# EAGLE design Noninvasive Nexmeter (EAGLE 9.5.0)
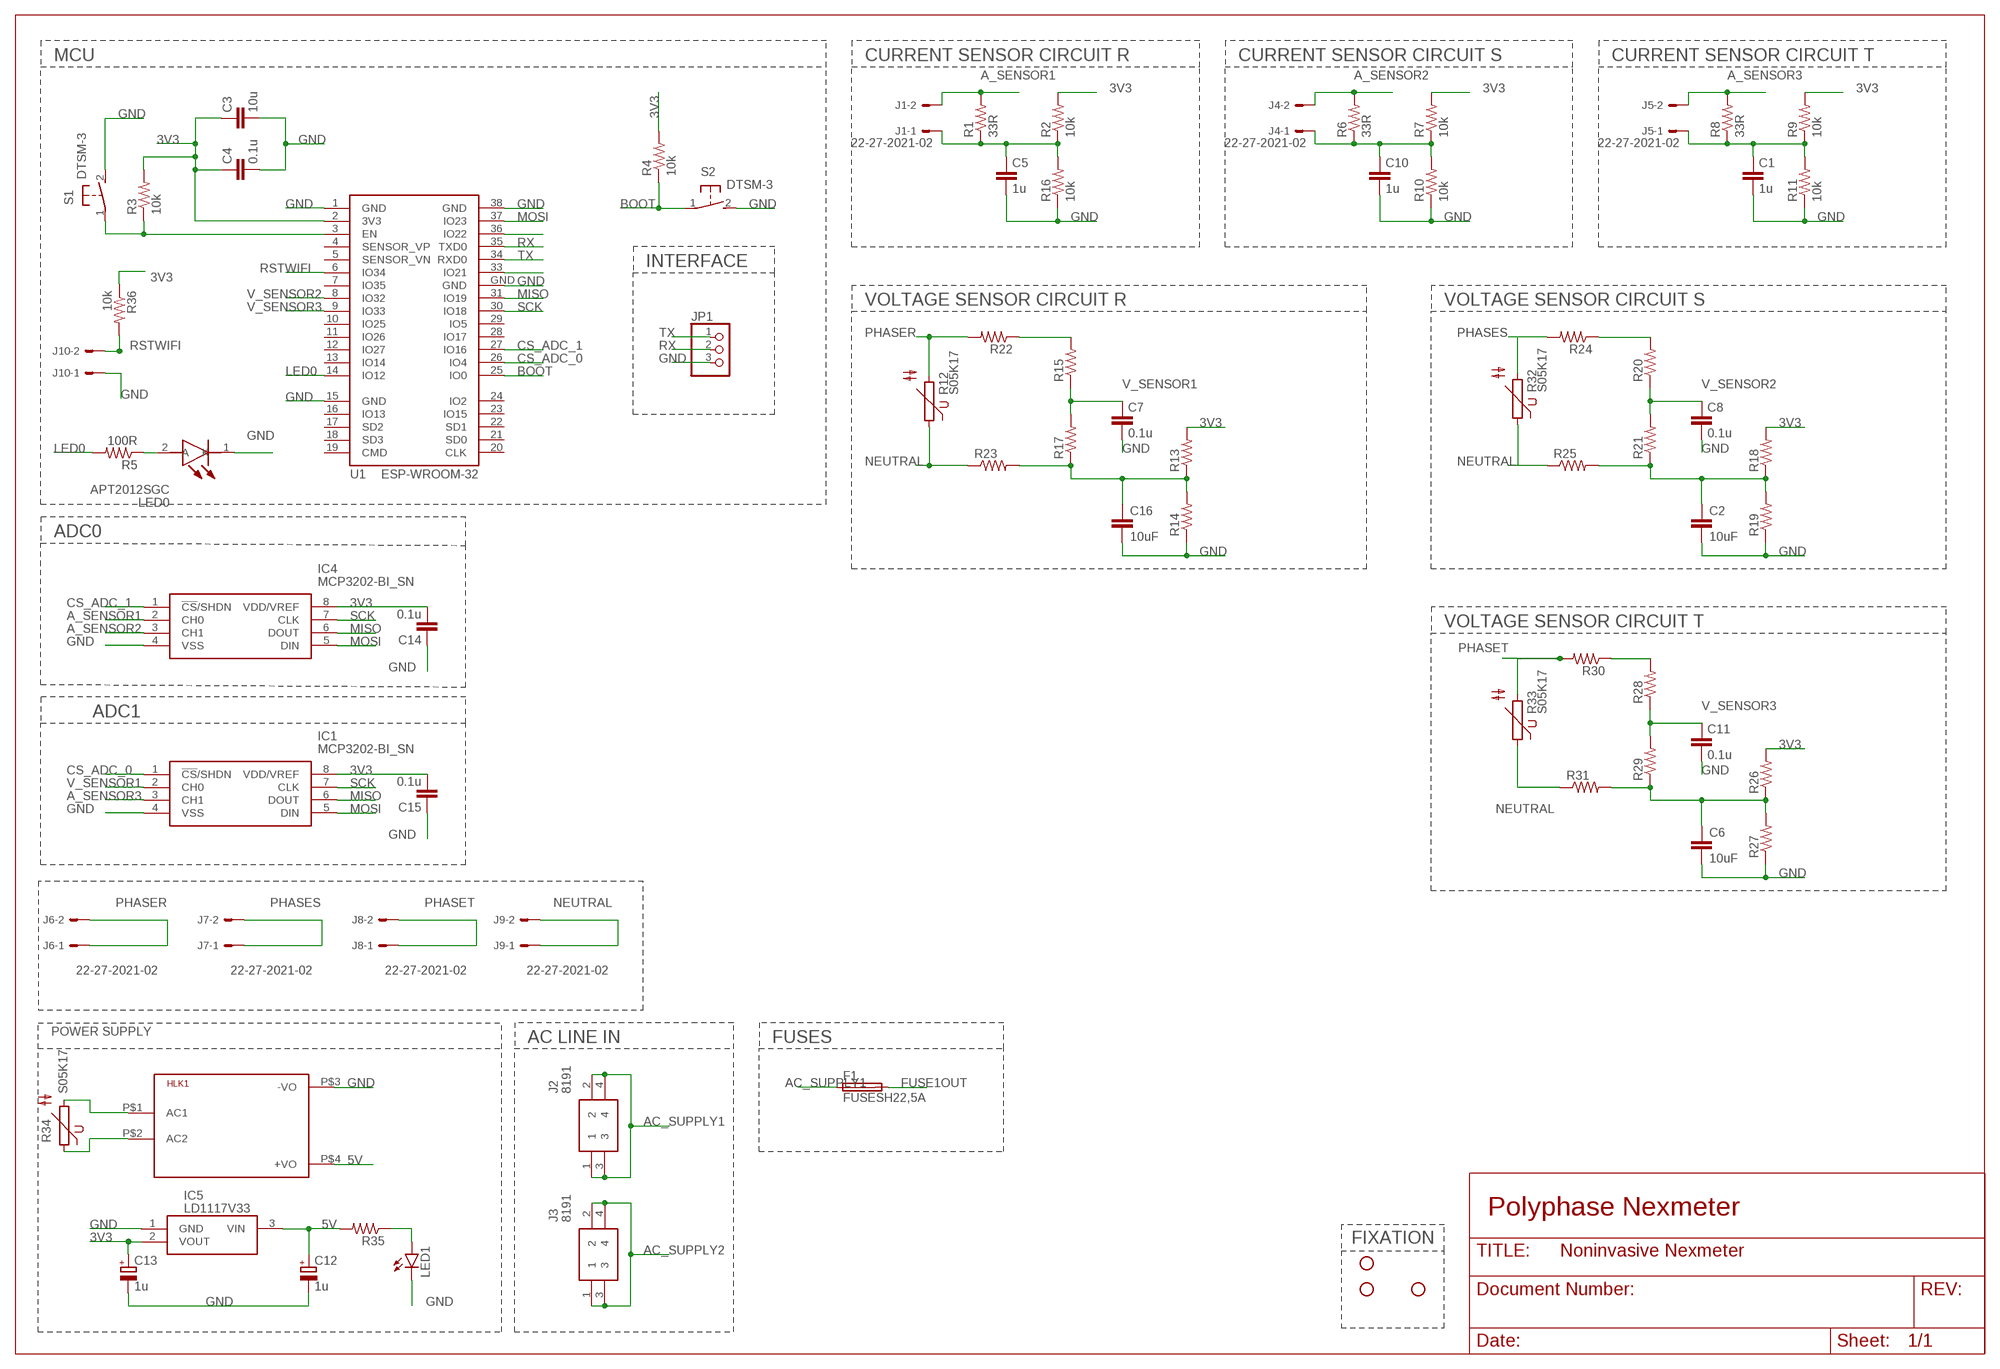
[diagram p0: schematic, sheet 1]

## Parts
C1  1u  C-EUC0805  [C0805]
C2  10uF  RCL_C-EUC0805  [RCL_C0805]
C3  10u  C-EUC0805  [C0805]
C4  0.1u  C-EUC0805  [C0805]
C5  1u  C-EUC0805  [C0805]
C6  10uF  RCL_C-EUC0805  [RCL_C0805]
C7  0.1u  C-EUC0805  [C0805]
C8  0.1u  C-EUC0805  [C0805]
C10  1u  C-EUC0805  [C0805]
C11  0.1u  C-EUC0805  [C0805]
C12  1u  CPOL-EUE1.8-4  [E1,8-4]
C13  1u  CPOL-EUE1.8-4  [E1,8-4]
C14  0.1u  C-EUC0805  [C0805]
C15  0.1u  C-EUC0805  [C0805]
C16  10uF  RCL_C-EUC0805  [RCL_C0805]
F1  FUSESH22,5A  [SH22,5A]
HLK1  HLK-PM013W  [HLK-PM01]
IC1  MCP3202-BI_SN  [SOIC127P600X175-8N]
IC4  MCP3202-BI_SN  [SOIC127P600X175-8N]
IC5  LD1117V33  [TO270P460X1020X2008-3P]
J1  22-27-2021-02  [6410-02]
J2  8191  [8191]
J3  8191  [8191]
J4  22-27-2021-02  [6410-02]
J5  22-27-2021-02  [6410-02]
J6  22-27-2021-02  [6410-02]
J7  22-27-2021-02  [6410-02]
J8  22-27-2021-02  [6410-02]
J9  22-27-2021-02  [6410-02]
J10  22-27-2021-02  [6410-02]
JP1  PINHD-1X3  [1X03]
LED0  APT2012SGC  [LEDC2012X85N]
LED1  LED5MM  [LED5MM]
R1  33R  R-US_R0805  [R0805]
R2  10k  R-US_R0805  [R0805]
R3  10k  R-US_R0805  [R0805]
R4  10k  R-US_R0805  [R0805]
R5  100R  R-US_R0805  [R0805]
R6  33R  R-US_R0805  [R0805]
R7  10k  R-US_R0805  [R0805]
R8  33R  R-US_R0805  [R0805]
R9  10k  R-US_R0805  [R0805]
R10  10k  R-US_R0805  [R0805]
R11  10k  R-US_R0805  [R0805]
R12  S05K17  [S05K17]
R13  RESISTOR0805  [0805]
R14  RESISTOR0805  [0805]
R15  RESISTOR0805  [0805]
R16  10k  R-US_R0805  [R0805]
R17  RESISTOR0805  [0805]
R18  RESISTOR0805  [0805]
R19  RESISTOR0805  [0805]
R20  RESISTOR0805  [0805]
R21  RESISTOR0805  [0805]
R22  RESISTOR0805  [0805]
R23  RESISTOR0805  [0805]
R24  RESISTOR0805  [0805]
R25  RESISTOR0805  [0805]
R26  RESISTOR0805  [0805]
R27  RESISTOR0805  [0805]
R28  RESISTOR0805  [0805]
R29  RESISTOR0805  [0805]
R30  RESISTOR0805  [0805]
R31  RESISTOR0805  [0805]
R32  S05K17  [S05K17]
R33  S05K17  [S05K17]
R34  S05K17  [S05K17]
R35  RESISTORAXIAL-0.3  [AXIAL-0.3]
R36  10k  R-US_R0805  [R0805]
S1  DTSM-3  [DTSM-3]
S2  DTSM-3  [DTSM-3]
STANDOFF1  STAND-OFF  [STAND-OFF]
STANDOFF2  STAND-OFF  [STAND-OFF]
STANDOFF4  STAND-OFF  [STAND-OFF]
U1  ESP-WROOM-32  [ESP-WROOM-32]

## Nets
3V3: C3.1 C4.1 C13.+ C14.2 C15.2 IC1.8(VDD/VREF) IC4.8(VDD/VREF) IC5.2(VOUT) R2.2 R3.2 R4.2 R7.2 R9.2 R13.2 R18.2 R26.2 R36.1 U1.2(3V3)
5V: C12.+ HLK1.P$4(+VO) IC5.3(VIN) R35.P$2
A_SENSOR1: IC4.2(CH0) J1.2 R1.2
A_SENSOR2: IC4.3(CH1) J4.2 R6.2
A_SENSOR3: IC1.3(CH1) J5.2 R8.2
AC_SUPPLY1: F1.1 J2.1 J2.2 J2.3 J2.4
AC_SUPPLY2: HLK1.P$2(AC2) J3.1 J3.2 J3.3 J3.4 R34.1
BOOT: R4.1 S2.1 U1.25(IO0)
CS_ADC_0: IC1.1(!CS!/SHDN) U1.26(IO4)
CS_ADC_1: IC4.1(!CS!/SHDN) U1.27(IO16)
FUSE1OUT: F1.2 HLK1.P$1(AC1) R34.2
GND: C1.2 C2.2 C3.2 C4.2 C5.2 C6.2 C7.2 C8.2 C10.2 C11.2 C12.- C13.- C14.1 C15.1 C16.2 HLK1.P$3(-VO) IC1.4(VSS) IC4.4(VSS) IC5.1(GND) J10.1 JP1.3 LED0.1(K) LED1.K(C) R10.1 R11.1 R14.1 R16.1 R19.1 R27.1 S1.2 S2.2 U1.1(GND) U1.15(GND) U1.38(GND) U1.GND
LED0: R5.2 U1.14(IO12)
MISO: IC1.6(DOUT) IC4.6(DOUT) U1.31(IO19)
MOSI: IC1.5(DIN) IC4.5(DIN) U1.37(IO23)
N$1: R20.2 R24.1
N$2: C1.1 J5.1 R8.1 R9.1 R11.2
N$3: C2.1 R18.1 R19.2 R21.1 R25.2
N$4: LED0.2(A) R5.1
N$5: R3.1 S1.1 U1.3(EN)
N$6: R28.2 R30.1
N$7: R15.2 R22.1
N$8: U1.33(IO21)
N$9: C10.1 J4.1 R6.1 R7.1 R10.2
N$10: C16.1 R13.1 R14.2 R17.1 R23.2
N$11: U1.36(IO22)
N$12: C6.1 R26.1 R27.2 R29.1 R31.2
N$13: LED1.A R35.P$1
N$16: C5.1 J1.1 R1.1 R2.1 R16.2
NEUTRAL: J9.1 J9.2 R12.1 R23.1 R25.1 R31.1 R32.1 R33.1
PHASER: J6.1 J6.2 R12.2 R22.2
PHASES: J7.1 J7.2 R24.2 R32.2
PHASET: J8.1 J8.2 R30.2 R33.2
RSTWIFI: J10.2 R36.2 U1.6(IO34)
RX: JP1.2 U1.35(TXD0)
SCK: IC1.7(CLK) IC4.7(CLK) U1.30(IO18)
TX: JP1.1 U1.34(RXD0)
V_SENSOR1: C7.1 IC1.2(CH0) R15.1 R17.2
V_SENSOR2: C8.1 R20.1 R21.2 U1.8(IO32)
V_SENSOR3: C11.1 R28.1 R29.2 U1.9(IO33)
Unconnected: U1.4(SENSOR_VP) U1.5(SENSOR_VN) U1.7(IO35) U1.10(IO25) U1.11(IO26) U1.12(IO27) U1.13(IO14) U1.16(IO13) U1.17(SD2) U1.18(SD3) U1.19(CMD) U1.20(CLK) U1.21(SD0) U1.22(SD1) U1.23(IO15) U1.24(IO2) U1.28(IO17) U1.29(IO5)

## Notes on the sheet
- MCU | CURRENT SENSOR CIRCUIT R | CURRENT SENSOR CIRCUIT S | CURRENT SENSOR CIRCUIT T
- INTERFACE
- VOLTAGE SENSOR CIRCUIT R | VOLTAGE SENSOR CIRCUIT S
- ADC0
- VOLTAGE SENSOR CIRCUIT T
- ADC1
- POWER SUPPLY
- AC LINE IN | FUSES
- Polyphase Nexmeter
- FIXATION

## Library data of the parts
C1 C3-C5 C7 C8 C10 C11 C14 C15 = rcl:C-EU: CAPACITOR, European symbol; SPICEPREFIX: C
C2 C6 C16 = ac_monitor:RCL_C-EU: CAPACITOR, European symbol; SPICEPREFIX: C
C12 C13 = rcl:CPOL-EU: POLARIZED CAPACITOR, European symbol; SPICEPREFIX: C
F1 = fuse:FUSE: Fuse; OC_FARNELL: unknown; OC_NEWARK: unknown
HLK1 = HLK-PM01:HLK-PM01: Hi-Link Power Supply HLK-PM01 3W Author: Ahmed Said <https://github.com/AhmedSaid/EAGLELibraries>
IC1 IC4 = SamacSys_Parts:MCP3202-BI_SN: IC, A-D, Converter, 12 bit, SMT, MCP3202BISN Source: Datasheet <https://componentsearchengine.com/Datasheets/1/MCP3202-BI_SN.pdf>; DESCRIPTION: IC, A-D, Converter, 12 bit, SMT, MCP3202BISN; HEIGHT: 1.75mm; MANUFACTURER_NAME: Microchip; MANUFACTURER_PART_NUMBER: MCP3202-BI/SN; MOUSER_PART_NUMBER: 579-MCP3202BISN; MOUSER_PRICE-STOCK: https://www.mouser.com/Search/Refine.aspx?Keyword=579-MCP3202BISN
IC5 = SamacSys_Parts:LD1117V33: 800mA,3.3V,LDO Voltage Reg.,LD1117V33 STMicroelectronics LD1117V33, LDO Voltage Regulator, 1.3A, 3.3 V +/-1%, 3-Pin TO-220 Source: Datasheet <https://componentsearchengine.com/Datasheets/1/LD1117V33.pdf>; DESCRIPTION: 800mA,3.3V,LDO Voltage Reg.,LD1117V33 STMicroelectronics LD1117V33, LDO Voltage Regulator, 1.3A, 3.3 V +/-1%, 3-Pin TO-220; HEIGHT: 4.6mm; MANUFACTURER_NAME: STMicroelectronics; MANUFACTURER_PART_NUMBER: LD1117V33; MOUSER_PART_NUMBER: 511-LD1117V33; MOUSER_PRICE-STOCK: https://www.mouser.com/Search/Refine.aspx?Keyword=511-LD1117V33
J1 J4-J10 = con-molex:22-?-02: CONNECTOR wire to board 2.54 mm (.1 inch) pitch header; MF: MOLEX; OC_FARNELL: unknown; OC_NEWARK: unknown
J2 J3 = SamacSys_Parts:8191: Screw terminal, PC mount, vertical, with screw, metal, 15 Amps Source: Datasheet <https://componentsearchengine.com/Datasheets/1/8191.pdf>; DESCRIPTION: Screw terminal, PC mount, vertical, with screw, metal, 15 Amps; HEIGHT: 6.56mm; MANUFACTURER_NAME: Keystone Electronics; MANUFACTURER_PART_NUMBER: 8191; MOUSER_PART_NUMBER: 534-8191; MOUSER_PRICE-STOCK: https://www.mouser.com/Search/Refine.aspx?Keyword=534-8191
JP1 = pinhead:PINHD-1X3: PIN HEADER
LED0 = SamacSys_Parts:APT2012SGC: 2.5 V Green LED 2012 (0805) SMD, Kingbright APT2012SGC Source: Datasheet <https://componentsearchengine.com/Datasheets/1/APT2012SGC.pdf>; DESCRIPTION: 2.5 V Green LED 2012 (0805) SMD, Kingbright APT2012SGC; HEIGHT: 0.85mm; MANUFACTURER_NAME: Kingbright; MANUFACTURER_PART_NUMBER: APT2012SGC; MOUSER_PART_NUMBER: 604-APT2012SGC; MOUSER_PRICE-STOCK: https://www.mouser.com/Search/Refine.aspx?Keyword=604-APT2012SGC
LED1 = led:LED: LED OSRAM: - CHIPLED LG R971, LG N971, LY N971, LG Q971, LY Q971, LO R971, LY R971 LH N974, LH R974 LS Q976, LO Q976, LY Q976 LO Q996 - Hyper CHIPLED LW Q18S LB Q993, LB Q99A, LB R99A - SideLED LS A670, LO A670, LY A670, LG A670, LP A670 LB A673, LV A673, LT A673, LW A673 LH A674 LY A675 LS A676, LA A676, LO A676, LY A676, LW A676 LS A679, LY A679, LG A679 - Hyper Micro SIDELED® LS Y876, LA Y876, LO Y876, LY Y876 LT Y87S - SmartLED LW L88C, LW L88S LB L89C, LB L89S, LG L890 LS L89K, LO L89K, LY L89K LS L896, LA L896, LO L896, LY L896 - TOPLED LS T670, LO T670, LY T670, LG T670, LP T670 LSG T670, LSP T670, LSY T670, LOP T670, LYG T670 LG T671, LOG T671, LSG T671 LB T673, LV T673, LT T673, LW T673 LH T674 LS T676, LA T676, LO T676, LY T676, LB T676, LH T676, LSB T676, LW T676 LB T67C, LV T67C, LT T67C, LS T67K, LO T67K, LY T67K, LW E67C LS E67B, LA E67B, LO E67B, LY E67B, LB E67C, LV E67C, LT E67C LW T67C LS T679, LY T679, LG T679 LS T770, LO T770, LY T770, LG T770, LP T770 LB T773, LV T773, LT T773, LW T773 LH T774 LS E675, LA E675, LY E675, LS T675 LS T776, LA T776, LO T776, LY T776, LB T776 LHGB T686 LT T68C, LB T68C - Hyper Mini TOPLED® LB M676 - Mini TOPLED Santana® LG M470 LS M47K, LO M47K, LY M47K Source: http://www.osram.convergy.de LUXEON: - LUMILED® LXK2-PW12-R00, LXK2-PW12-S00, LXK2-PW14-U00, LXK2-PW14-V00 LXK2-PM12-R00, LXK2-PM12-S00, LXK2-PM14-U00 LXK2-PE12-Q00, LXK2-PE12-R00, LXK2-PE12-S00, LXK2-PE14-T00, LXK2-PE14-U00 LXK2-PB12-K00, LXK2-PB12-L00, LXK2-PB12-M00, LXK2-PB14-N00, LXK2-PB14-P00, LXK2-PB14-Q00 LXK2-PR12-L00, LXK2-PR12-M00, LXK2-PR14-Q00, LXK2-PR14-R00 LXK2-PD12-Q00, LXK2-PD12-R00, LXK2-PD12-S00 LXK2-PH12-R00, LXK2-PH12-S00 LXK2-PL12-P00, LXK2-PL12-Q00, LXK2-PL12-R00 Source: www.luxeon.com KINGBRIGHT: KA-3528ASYC Source: www.kingbright.com
R1-R11 R16 R36 = rcl:R-US_: RESISTOR, American symbol; SPICEPREFIX: R
R12 R32-R34 = varistor:S05K17: VARISTOR
R13-R15 R17-R31 R35 = SparkFun-Resistors:RESISTOR: Generic Resistor Package
S1 S2 = switch-tact:DTSM-3
STANDOFF1 STANDOFF2 STANDOFF4 = SparkFun-Hardware:STAND-OFF: Stand Off Drill holes for mechanically mounting via screws, standoffs, etc. Note: Use the keepout ring to avoid running the screw head into surrounding components. Variant Overviews STAND-OFF - Mechanical footprint for a #4 phillips button head screw. STAND-OFF-TIGHT - Mechanical footprint for a #4 phillips button head screw, Example SparkFun Products Screw - Phillips Head (1/4", 4-40, 10 pack) <https://www.sparkfun.com/products/10453> (PRT-10453) Screw - Phillips Head (1/2", 4-40, 10 pack) <https://www.sparkfun.com/products/10452> (PRT-10452) Screw - Phillips Head (3/4", 4-40, 10 pack) <https://www.sparkfun.com/products/10451> (PRT-10451) Screw - Phillips Head (1", 4-40, 10 pack) <https://www.sparkfun.com/products/10450> (PRT-10450)
U1 = esp32:ESP-WROOM-32: Espressif Systems ESP-WROOM-32

## Board
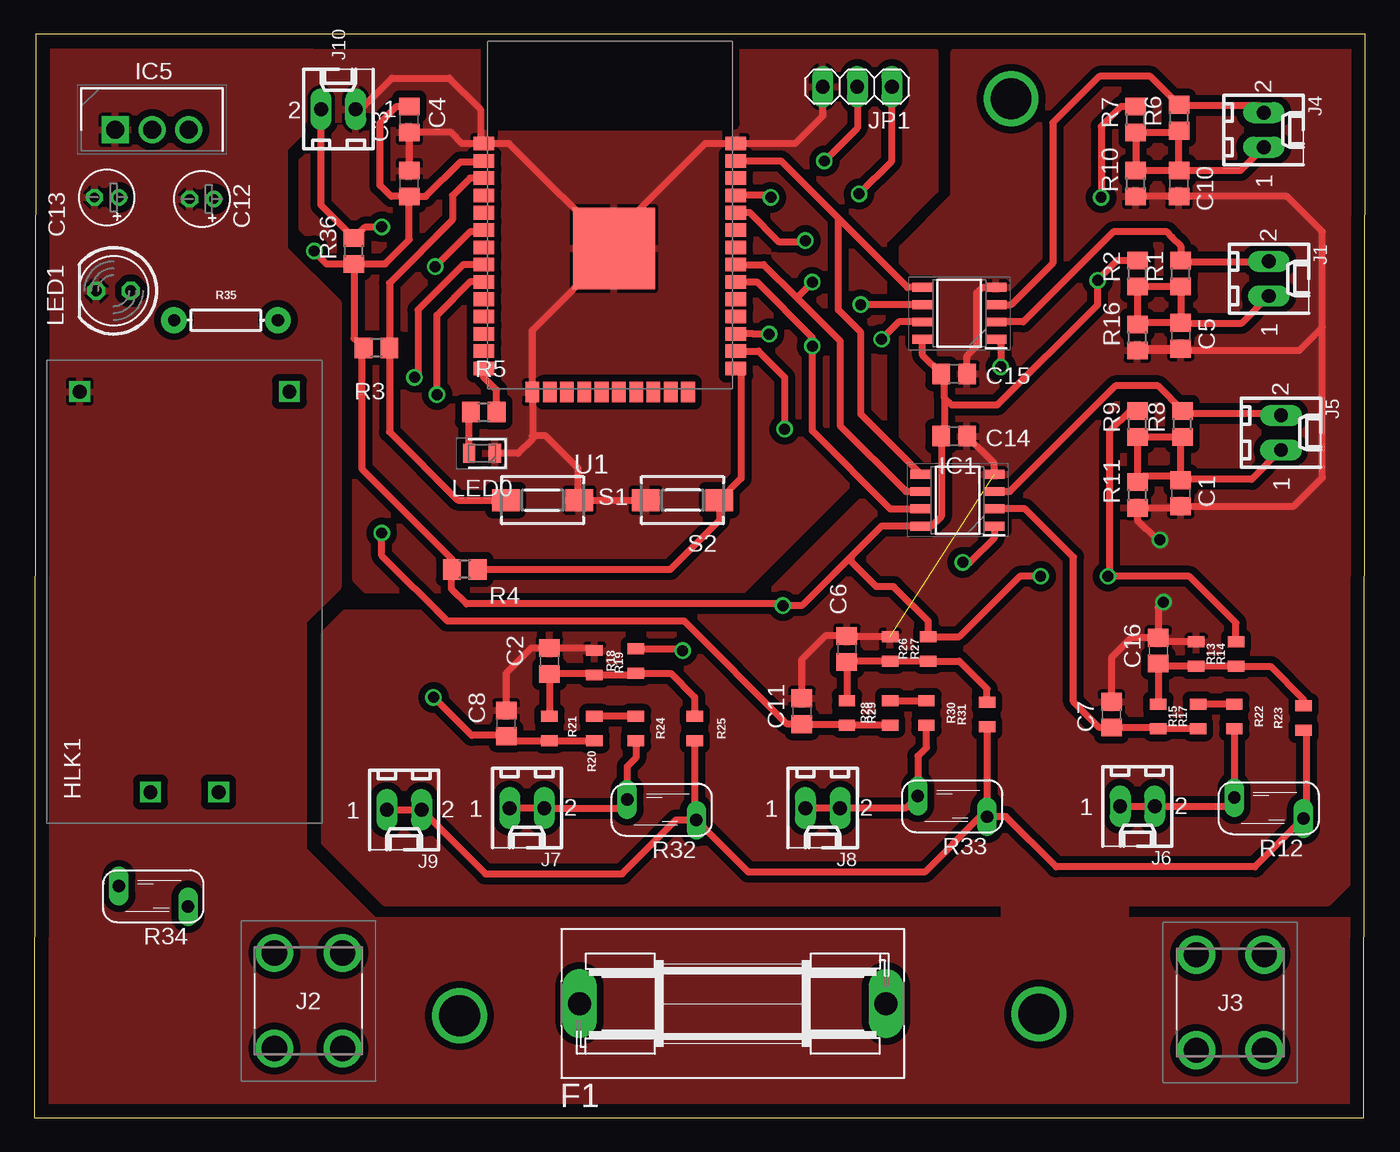
[diagram p1: board, top side]
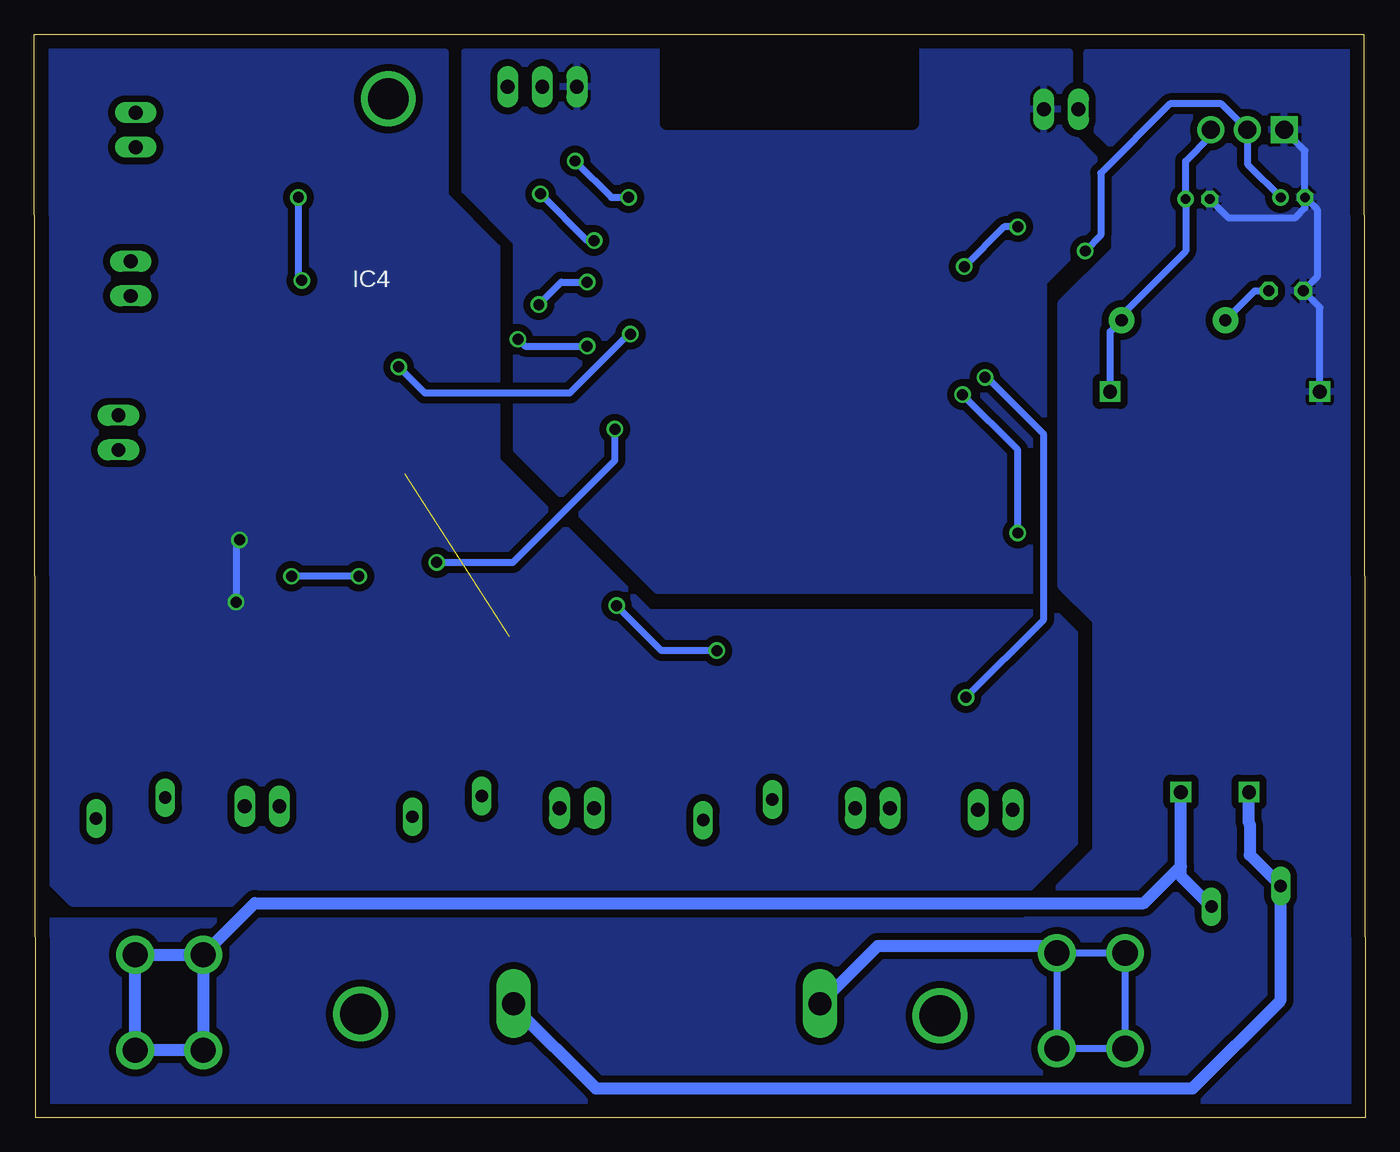
[diagram p2: board, bottom side, seen from below]

Size 97.77 x 79.55 mm. Coordinates in mm from the lower left corner, seen from the top.
Outline: 0,0 97.64,0 97.77,79.55 0.13,79.55 0,0
Copper layers (1*16): Top 0.035mm / dielectric 1.5mm / Bottom 0.035mm
Design rules "default *": minimum track width 10mil, minimum drill 0.35mm, track to track 10mil, track to pad 10mil, pad to pad 10mil, via to via 10mil, smd to smd 10mil, copper to edge 40mil, drill to drill 6mil, minimum pad ring 10mil, minimum via ring 8mil, stop-mask expansion 4mil, vias tented up to drill 0mil, thermal gap 10mil

### Footprints (pad centres in the part's own frame; a part is rotated, then mirrored left to right if it is on the bottom)
C0805 = smd 1.3 x 1.5: 1 -0.95,0; 2 0.95,0
RCL_C0805 = smd 1.3 x 1.5: 1 -0.95,0; 2 0.95,0
E1,8-4 = drill 0.711 pad 1.168: + -0.889,0 | drill 0.711 pad 1.168 octagon: - 0.889,0
SH22,5A = drill 1.7 pad 2.54 long: 1 -11.252,0; 2 11.252,0
HLK-PM01 = drill 1.016 square: P$1 -14.7,2.5; P$2 -14.7,-2.5; P$3 14.7,7.7; P$4 14.7,-7.7
SOIC127P600X175-8N = smd 1.5 x 0.65: 1 -2.7,1.905; 2 -2.7,0.635; 3 -2.7,-0.635; 4 -2.7,-1.905; 5 2.7,-1.905; 6 2.7,-0.635; 7 2.7,0.635; 8 2.7,1.905
TO270P460X1020X2008-3P = drill 1.32 pad 1.98 square: 1 0,0 | drill 1.32 pad 1.98: 2 2.7,0; 3 5.4,0
6410-02 = drill 1.016 long: 1 1.27,0; 2 -1.27,0
8191 = drill 1.85 pad 2.775: 1 0,0; 2 5,0; 3 5,7.01; 4 0,7.01
1X03 = drill 1.016 long: 1 -2.54,0; 2 0,0; 3 2.54,0
LEDC2012X85N = smd 0.9 x 1.4: 1 -0.95,0; 2 0.95,0
LED5MM = drill 0.813 octagon: A -1.27,0; K 1.27,0
R0805 = smd 1.3 x 1.5: 1 -0.95,0; 2 0.95,0
S05K17 = drill 0.914 long: 1 -0.762,-2.54; 2 0.762,2.54
0805 = smd 0.8 x 1.2: 1 -0.9,0; 2 0.9,0
AXIAL-0.3 = drill 0.9 pad 1.88: P$1 -3.81,0; P$2 3.81,0
DTSM-3 = smd 2 x 1.6: 1 -2.7,0; 2 2.7,0
STAND-OFF = hole 3.2: 0,0
ESP-WROOM-32 = smd 1.5 x 1: 1 -9.25,7; 2 -9.25,5.73; 3 -9.25,4.46; 4 -9.25,3.19; 5 -9.25,1.92; 6 -9.25,0.65; 7 -9.25,-0.62; 8 -9.25,-1.89; 9 -9.25,-3.16; 10 -9.25,-4.43; 11 -9.25,-5.7; 12 -9.25,-6.97; 13 -9.25,-8.24; 14 -9.25,-9.51; 25 9.25,-9.51; 26 9.25,-8.24; 27 9.25,-6.97; 28 9.25,-5.7; 29 9.25,-4.43; 30 9.25,-3.16; 31 9.25,-1.89; 32 9.25,-0.62; 33 9.25,0.65; 34 9.25,1.92; 35 9.25,3.19; 36 9.25,4.46; 37 9.25,5.73; 38 9.25,7 | smd 1 x 1.5: 15 -5.7,-11.25; 16 -4.43,-11.25; 17 -3.16,-11.25; 18 -1.89,-11.25; 19 -0.62,-11.25; 20 0.65,-11.25; 21 1.92,-11.25; 22 3.19,-11.25; 23 4.46,-11.25; 24 5.73,-11.25 | smd 6 x 6: GND 0.3,-0.7

### Placement (x,y rotation side)
C1  84.2,45.85 270 top
C2  37.85,33.53 90 top
C3  27.56,73.28 270 top
C4  27.56,68.58 90 top
C5  84.2,57.4 270 top
C6  59.69,34.42 90 top
C7  79.12,29.59 90 top
C8  34.67,28.96 90 top
C10  84.07,68.58 270 top
C11  56.39,29.85 90 top
C12  12.32,67.44 180 top
C13  5.33,67.56 180 top
C14  67.56,50.04 180 top
C15  67.56,54.61 180 top
C16  82.55,34.29 90 top
F1  51.31,8.38 0 top
HLK1  11.05,38.61 90 top
IC1  67.82,45.34 180 top
IC4  67.95,59.06 180 top
IC5  5.97,72.52 0 top
J1  90.68,61.59 270 top
J2  17.65,5.08 0 top
J3  85.34,4.95 0 top
J4  90.3,72.52 270 top
J5  91.57,50.29 270 top
J6  81.03,22.86 180 top
J7  36.2,22.73 180 top
J8  57.91,22.73 180 top
J9  27.18,22.61 180 top
J10  22.35,74.04 0 top
JP1  60.45,75.69 180 top
LED0  32.89,48.77 180 top
LED1  5.84,60.71 180 top
R1  84.2,61.98 90 top
R2  81.03,61.98 90 top
R3  25.15,56.52 180 top
R4  31.62,40.26 180 top
R5  33.02,51.82 0 top
R6  84.07,73.41 90 top
R7  80.9,73.28 90 top
R8  84.33,50.93 90 top
R9  81.03,50.93 90 top
R10  80.9,68.58 90 top
R11  81.03,45.72 90 top
R12  90.68,22.73 90 top
R13  88.27,34.04 90 top
R14  85.34,34.04 270 top
R15  85.47,29.46 90 top
R16  81.03,57.28 90 top
R17  82.55,29.46 270 top
R18  44.2,33.53 90 top
R19  41.15,33.4 270 top
R20  41.15,28.57 90 top
R21  37.85,28.57 270 top
R22  88.14,29.46 270 top
R23  93.22,29.34 90 top
R24  44.2,28.57 270 top
R25  48.51,28.57 90 top
R26  65.66,34.42 90 top
R27  62.87,34.42 270 top
R28  62.87,29.72 90 top
R29  59.69,29.72 270 top
R30  65.53,29.72 270 top
R31  69.98,29.59 90 top
R32  46.1,22.61 90 top
R33  67.44,22.86 90 top
R34  8.76,16.26 90 top
R35  14.1,58.55 0 top
R36  23.5,63.63 90 top
S1  37.34,45.34 0 top
S2  47.62,45.34 180 top
STANDOFF1  -227.2,130.3 0 top  (outside the outline)
STANDOFF2  -239.9,130.3 0 top  (outside the outline)
STANDOFF4  -233.55,130.3 0 top  (outside the outline)
U1  42.29,64.52 0 top

### Tracks (layer width: path | path; a pad name or v marks a point on that pad's centre or on a via)
3V3  (via drill 0.8)
  Top 0.508: C3.1 26.6,74.23 25.4,73.03 25.4,68.45 26.22,67.63 C4.1 | IC4.8 65.25,55.98 C15.2 66.81,54.42 66.81,54.16 66.87,54.1 66.87,52.83 | R36.1 25.78,62.68 27.56,64.45 C4.1 | 66.87,52.83 66.87,50.29 C14.2 66.61,44.14 65.91,43.43 IC1.8 62.23,43.43 60.01,41.21 | R36.1 23.5,57.22 R3.2 24.1,56.42 24.1,47.59 30.67,41.02 R4.2 30.67,38.8 31.75,37.72 54.86,37.72 v54.99,37.59 56.39,37.59 60.01,41.21 | v20.57,63.63 20.57,63.57 21.46,62.68 R36.1 | 66.87,52.83 67.38,52.32 70.74,52.32 78.11,59.69 v78.11,61.47 78.11,61.53 79.5,62.93 R2.2 | R13.2 88.27,36.33 84.85,39.75 v78.87,39.75 78.99,39.62 78.99,50.42 80.45,51.88 R9.2 | R7.2 79.81,74.23 78.36,72.78 v78.36,67.56 | v73.91,39.75 72.38,39.75 67.95,35.32 R26.2 65.66,36.45 63.12,38.99 61.85,38.99 60.01,40.83 60.01,41.21 | R18.2 47.49,34.43 v47.62,34.29 | U1.2 33.12,70.17 31.31,70.17 28.77,67.63 C4.1
  Bottom 0.508: C13.+ 8.67,70.01 IC5.2 10.57,74.42 14.35,74.42 19.43,69.34 19.43,64.77 v20.57,63.63 | v78.36,67.56 78.36,61.72 v78.11,61.47 | v73.91,39.75 v78.87,39.75 | v54.99,37.59 51.69,34.29 v47.62,34.29
5V
  Bottom 0.508: IC5.3 11.37,72.07 13.21,70.23 C12.+ 13.21,63.63 17.91,58.93 R35.P$2 18.75,57.7 HLK1.P$4
A_SENSOR1
  Top 0.508: J1.2 90.61,62.8 84.33,62.8 R1.2 84.2,64.01 83.57,64.64 | 83.57,64.64 83.19,65.02 79.25,65.02 72.64,58.42 IC4.2 | 83.57,64.64
A_SENSOR2
  Top 0.508: J4.2 90.04,74.04 90.04,74.3 84.14,74.3 R6.2 81.98,76.45 78.23,76.45 74.8,73.03 74.8,62.74 71.76,59.69 IC4.3
A_SENSOR3
  Top 0.508: J5.2 91.57,51.69 84.52,51.69 R8.2 84.33,51.94 82.55,53.72 79.41,53.72 71.66,45.97 IC1.3
AC_SUPPLY1
  Bottom 0.508: J2.3 J2.2 J2.1 J2.4 J2.3
  Bottom 0.889: F1.1 35.82,12.62 23.18,12.62 J2.3
AC_SUPPLY2
  Bottom 0.889: J3.4 81.56,15.75 16.26,15.75 13.55,18.46 | J3.4 J3.1 J3.2 J3.3 J3.4 | 13.55,18.46 13.55,17.74 R34.1 | 13.55,18.46 HLK1.P$2
BOOT
  Top 0.508: U1.25 51.92,54.62 51.92,46.94 S2.1 50.33,43.85 46.74,40.26 R4.1
CS_ADC_0  (via drill 0.8)
  Top 0.508: IC1.1 70.52,42.55 68.74,40.77 v68.2,40.77 | v55.12,50.55 55.12,54.36 53.2,56.28 U1.26
  Bottom 0.508: v68.2,40.77 62.61,40.77 55.12,48.26 v55.12,50.55
CS_ADC_1  (via drill 0.8)
  Top 0.508: IC4.1 70.99,56.8 v70.99,55.12 | v53.98,57.53 52.83,57.53 52.81,57.55 U1.27
  Bottom 0.508: v70.99,55.12 69.09,53.21 58.42,53.21 54.1,57.53 v53.98,57.53
FUSE1OUT
  Bottom 0.508: F1.2 62.56,8.2
  Bottom 0.889: 62.56,8.2 56.52,2.16 12.7,2.16 6.22,8.64 R34.2 8.51,19.3 8.51,21.58 8.55,21.62 HLK1.P$1
GND  (via drill 0.8)  (1 unrouted)
  Top 0.508: R19.1 40.97,34.48 C2.2 36.51,34.48 34.67,32.64 C8.2 | R27.1 62.85,35.31 59.75,35.31 C6.2 58.1,35.37 56.39,33.66 C11.2 | R14.1 82.85,34.94 C16.2 | C16.2 80.58,35.24 79.12,33.78 C7.2 | C5.2 81.15,56.45 R16.1 92.9,56.33 94.62,58.04 | R10.1 C10.2 92.01,67.63 94.62,65.02 94.62,58.04 | S2.2 S1.2 39.91,45.47 39.91,47.72 37.58,50.05 36.59,50.05 | U1.1 32.79,71.77 32.79,74.02 30.48,76.33 26.29,76.33 23.62,73.66 J10.1 | C4.2 C3.2 30.61,72.33 31.42,71.52 U1.1 | IC1.4 70.52,48.03 C14.1 | C15.1 68.51,55.94 69.23,56.66 69.23,60.56 69.63,60.96 IC4.4 | 94.62,58.04 94.62,46.99 92.52,44.9 C1.2 84.07,44.77 R11.1 81.03,43.88 82.49,42.42 v82.68,42.42 | v82.93,37.85 82.55,37.47 C16.2 | U1.GND 36.59,57.82 U1.15 36.59,50.05 | U1.GND 34.89,71.52 U1.1 | U1.GND 42.59,64.83 49.28,71.52 U1.38 55.89,71.52 57.91,73.53 JP1.3 | 36.59,50.05 36.59,49.8 35.56,48.77 LED0.1
  Bottom 0.508: C13.- 4.45,70.99 IC5.1 | C13.- 4.45,66.8 5.21,66.04 10.03,66.04 C12.- | C13.- 3.56,66.68 3.56,61.72 LED1.K 3.35,59.48 HLK1.P$3 | v82.68,42.42 82.93,42.16 v82.93,37.85
  pour Top (isolate 0.508): 67.56,78.23 96.65,78.23 96.65,17.4 95,15.75 25.78,15.75 21.34,20.19 21.34,35.56 22.86,37.08 52.58,37.08 63.75,48.26 63.75,63.88 67.56,67.69
  pour Top (isolate 0.508): 20.45,78.23 1.02,78.23 1.02,0.76 96.52,0.76 96.65,0.89 96.65,14.48 25.02,14.48 19.81,19.68 19.81,36.45 22.35,38.99 22.35,59.82 18.42,63.75 18.42,71.12 20.45,73.15
  pour Top (isolate 0.508): 21.72,78.23 66.17,78.23 66.17,68.07 62.36,64.26 62.36,49.02 52.07,38.73 24.38,38.73 23.62,39.5 23.62,61.34 19.69,65.28 19.69,70.23 21.72,72.26
  pour Bottom (isolate 0.508): 20.45,78.23 1.02,78.23 1.02,0.76 96.52,0.76 96.65,0.89 96.65,14.48 25.02,14.48 19.81,19.68 19.81,36.45 22.35,38.99 22.35,59.82 18.42,63.75 18.42,71.12 20.45,73.15
  pour Top: 19.18,78.23 22.99,78.23 22.99,73.28 19.18,73.28
  pour Top: 71.25,17.27 80.14,17.27 80.14,12.19 71.25,12.19
  pour Bottom (isolate 0.508): 67.56,78.23 96.65,78.23 96.65,17.4 95,15.75 25.78,15.75 21.34,20.19 21.34,35.56 22.86,37.08 52.58,37.08 63.75,48.26 63.75,63.88 67.56,67.69
  pour Bottom (isolate 0.508): 21.72,78.23 66.17,78.23 66.17,68.07 62.36,64.26 62.36,49.02 52.07,38.73 24.38,38.73 23.62,39.5 23.62,61.34 19.69,65.28 19.69,70.23 21.72,72.26
LED0
  Top 0.508: U1.14 33.04,54.51 33.02,54.49 33.02,54.36 33.97,53.41 R5.2
MISO  (via drill 0.8)
  Top 0.508: IC1.6 64.01,45.97 59.18,50.8 59.18,57.02 56.01,60.2 | v57.15,61.34 56.01,60.2 | 56.01,60.2 53.58,62.63 U1.31 | IC4.6 v60.71,59.69
  Bottom 0.508: v60.71,59.69 59.06,61.34 v57.15,61.34
MOSI
  Top 0.508: U1.37 54.85,70.25 59.06,66.04 | IC1.5 60.71,51.66 60.71,57.66 59.06,59.31 59.06,66.04 | IC4.5 64.14,60.96 59.06,66.04
N$1
  Top 0.508: R24.1 R20.2
N$2
  Top 0.508: C1.1 84.2,47.12 81.47,47.12 R11.2 R9.1 R8.1 84.2,49.85 C1.1 | J5.1 89.41,46.86 84.27,46.86 C1.1
N$3
  Top 0.508: R21.1 C2.1 41.07,32.58 R19.2 44.07,32.5 R18.1 46.76,32.63 48.51,30.87 R25.2
N$4
  Top 0.508: LED0.2 31.94,51.69 R5.1
N$5
  Top 0.508: S1.1 31.12,45.34 26.1,50.36 R3.1 26.1,61.28 30.73,65.91 30.73,67.69 32.02,68.98 U1.3
N$6
  Top 0.508: R28.2 R30.1
N$7
  Top 0.508: R22.1 R15.2
N$9
  Top 0.508: C10.1 84.07,72.08 83.88,72.27 | 83.88,72.27 R6.1 | C10.1 R10.2 R7.1 83.82,72.33 83.88,72.27 | J4.1 88.58,69.53 C10.1
N$10
  Top 0.508: R17.1 C16.1 82.75,33.14 R14.2 R13.1 90.81,33.14 93.22,30.72 R23.2
N$12
  Top 0.508: R29.1 C6.1 59.64,33.52 R27.2 R26.1 67.95,33.52 69.98,31.49 R31.2
N$13
  Bottom 0.508: R35.P$1 8.13,60.71 LED1.A
N$14  (via drill 3)
  other vias: 71.76,74.8
N$15  (via drill 3)
  other vias: 73.79,7.62
N$16
  Top 0.508: C5.1 R1.1 R2.1 R16.2 81.15,58.35 C5.1 | C5.1 84.58,58.35 84.64,58.29 88.65,58.29 J1.1
N$17  (via drill 3)
  other vias: 31.24,7.49
NEUTRAL
  Top 0.508: R25.1 48.51,21.97 R32.1 | R23.1 93.47,28.18 93.47,22.23 R12.1 89.66,18.42 75.06,18.42 71.37,22.1 R33.1 | J9.1 J9.2 33.15,17.91 43.18,17.91 47.12,21.84 R32.1 | R32.1 52.45,18.03 65.41,18.03 69.47,22.1 R33.1 | R31.1 R33.1
PHASER
  Top 0.508: R22.2 R12.2 87.5,22.86 J6.2 J6.1
PHASES
  Top 0.508: J7.1 J7.2 42.93,22.73 R32.2 43.56,25.78 44.2,26.42 R24.2
PHASET
  Top 0.508: R30.2 65.53,27.18 64.9,26.54 R33.2 64.01,22.73 J8.2 J8.1
RSTWIFI  (via drill 0.8)
  Top 0.508: J10.2 21.08,66.99 R36.2 24.32,65.41 v25.53,65.41 | U1.6 32.91,65.04 32.02,65.04 v29.46,62.48
  Bottom 0.508: v25.53,65.41 26.54,65.41 v29.46,62.48
RX  (via drill 0.8)
  Top 0.508: JP1.2 60.45,72.64 v58.04,70.23 | v54.1,67.56 53.96,67.71 U1.35
  Bottom 0.508: v58.04,70.23 55.37,67.56 v54.1,67.56
SCK  (via drill 0.8)
  Top 0.508: IC4.7 63.5,58.42 v62.23,57.15 | IC1.7 62.87,44.7 57.15,50.42 v57.15,56.64 57.15,57.28 53.07,61.36 U1.30
  Bottom 0.508: v62.23,57.15 61.72,56.64 v57.15,56.64
TX  (via drill 0.8)
  Top 0.508: v56.64,64.39 56.53,64.28 54.72,64.28 52.56,66.44 U1.34 | v60.58,67.82 62.99,70.23 JP1.1
  Bottom 0.508: v56.64,64.39 57.15,64.39 v60.58,67.82
V_SENSOR1
  Top 0.508: R15.1 R17.2 82.47,28.64 C7.1 78.23,28.64 76.33,30.55 76.33,41.15 72.77,44.7 IC1.2
V_SENSOR2  (via drill 0.8)
  Top 0.508: R20.1 R21.2 35,27.68 C8.1 34.61,28.07 32.13,28.07 v29.34,30.86 | v27.94,54.36 28.19,54.61 28.19,59.31 31.51,62.63 U1.8
  Bottom 0.508: v27.94,54.36 27.81,54.36 23.62,50.17 23.62,36.58 v29.34,30.86
V_SENSOR3  (via drill 0.8)
  Top 0.508: R28.1 R29.2 59.61,28.89 C11.1 55.31,28.89 47.75,36.45 30.35,36.45 25.53,41.28 v25.53,42.93 | v29.59,53.09 29.59,58.93 32.02,61.36 U1.9
  Bottom 0.508: v25.53,42.93 25.53,49.02 v29.59,53.09